# EAGLE schematic GBADVI (EAGLE 9.6.2)

## Sheet 1 of 3
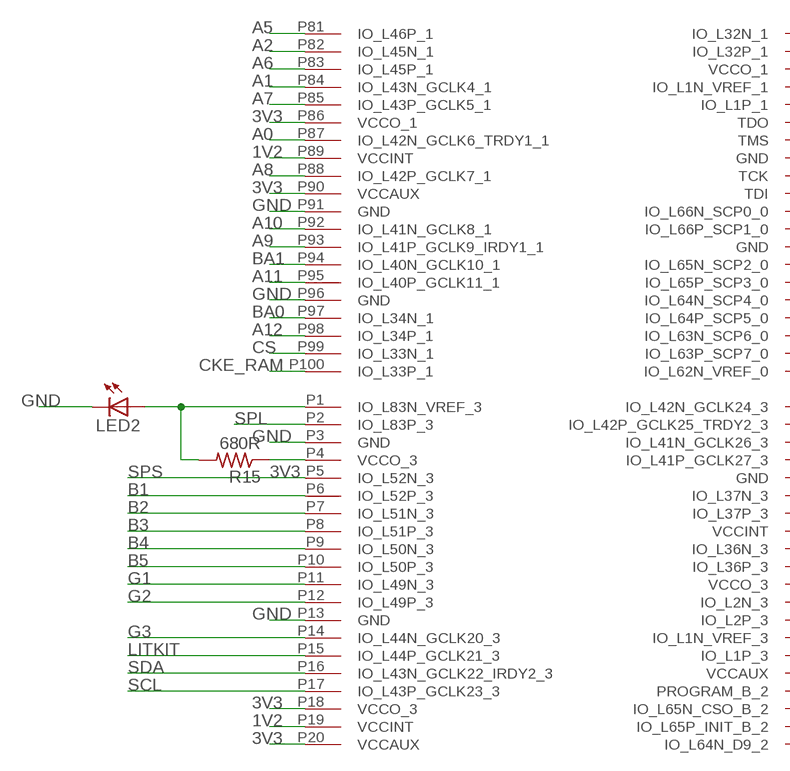
[diagram p0: schematic, sheet 1, part 1 of 2]
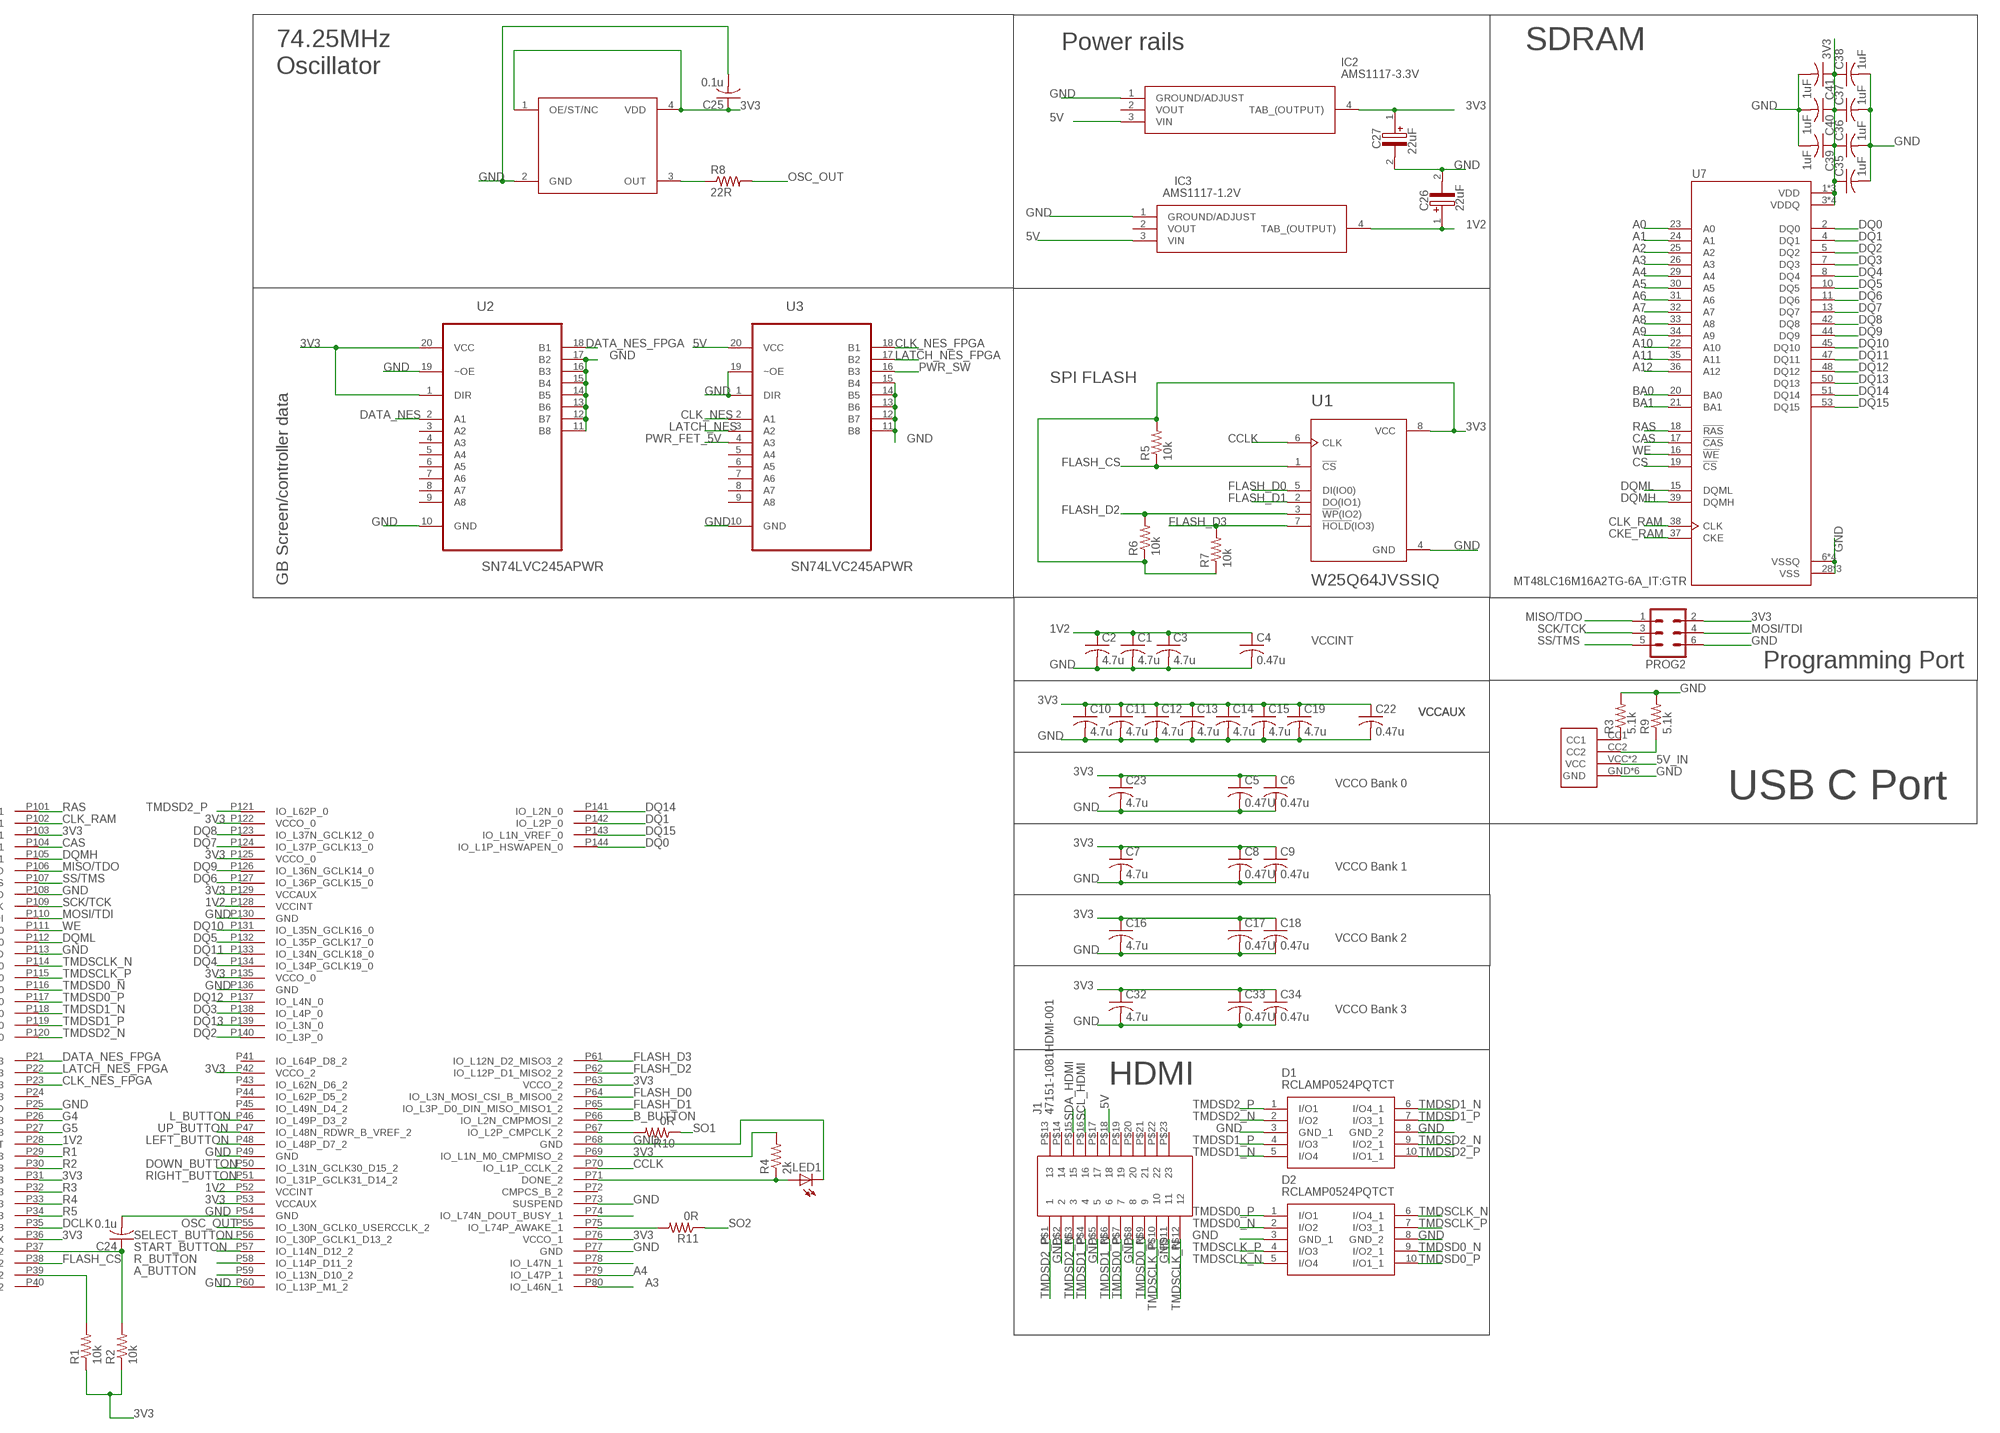
[diagram p1: schematic, sheet 1, part 2 of 2]

### Parts
C1  4.7u  C-USC0603  [C0603]
C2  4.7u  C-USC0603  [C0603]
C3  4.7u  C-USC0603  [C0603]
C4  0.47u  C-USC0603  [C0603]
C5  0.47U  C-USC0603  [C0603]
C6  0.47u  C-USC0603  [C0603]
C7  4.7u  C-USC0603  [C0603]
C8  0.47U  C-USC0603  [C0603]
C9  0.47u  C-USC0603  [C0603]
C10  4.7u  C-USC0603  [C0603]
C11  4.7u  C-USC0603  [C0603]
C12  4.7u  C-USC0603  [C0603]
C13  4.7u  C-USC0603  [C0603]
C14  4.7u  C-USC0603  [C0603]
C15  4.7u  C-USC0603  [C0603]
C16  4.7u  C-USC0603  [C0603]
C17  0.47U  C-USC0603  [C0603]
C18  0.47u  C-USC0603  [C0603]
C19  4.7u  C-USC0603  [C0603]
C22  0.47u  C-USC0603  [C0603]
C23  4.7u  C-USC0603  [C0603]
C24  0.1u  C-USC0603  [C0603]
C25  0.1u  C-USC0603  [C0603]
C26  22uF  293D106X9016A2TE3  [CAPPM3216X180N]
C27  22uF  293D106X9016A2TE3  [CAPPM3216X180N]
C32  4.7u  C-USC0603  [C0603]
C33  0.47U  C-USC0603  [C0603]
C34  0.47u  C-USC0603  [C0603]
C35  1uF  C-USC0603  [C0603]
C36  1uF  C-USC0603  [C0603]
C37  1uF  C-USC0603  [C0603]
C38  1uF  C-USC0603  [C0603]
C39  1uF  C-USC0603  [C0603]
C40  1uF  C-USC0603  [C0603]
C41  1uF  C-USC0603  [C0603]
D1  RCLAMP0524PQTCT  [RCLAMP0524P]
D2  RCLAMP0524PQTCT  [RCLAMP0524P]
IC2  AMS1117-3.3V  [SOT229P700X180-4N]
IC3  AMS1117-1.2V  AMS1117-3.3V  [SOT229P700X180-4N]
J1  47151-1081HDMI-001  [HDMI-001]
LED1  LEDCHIP-LED0603  [CHIP-LED0603]
LED2  LEDCHIP-LED0603  [CHIP-LED0603]
PROG2  MA03-2  [MA03-2]
R1  10k  R-US_R0603  [R0603]
R2  10k  R-US_R0603  [R0603]
R3  5.1k  R-US_R0603  [R0603]
R4  2k  R-US_R0603  [R0603]
R5  10k  R-US_R0603  [R0603]
R6  10k  R-US_R0603  [R0603]
R7  10k  R-US_R0603  [R0603]
R8  22R  R-US_R0603  [R0603]
R9  5.1k  R-US_R0603  [R0603]
R10  0R  R-US_R0603  [R0603]
R11  0R  R-US_R0603  [R0603]
R15  680R  R-US_R0603  [R0603]
U1  W25Q64JVSSIQ  W25Q64BVSSIG  [SOIC127P790X216-8N]
U2  SN74LVC245APWR  [SOP65P640X120-20N]
U3  SN74LVC245APWR  [SOP65P640X120-20N]
U7  MT48LC16M16A2TG-6A_IT:GTR  [SOP80P1176X120-54N]
U$1  O50327425MEDH4MI  SIT1602BI-82-33E-75.250000YO50327425MEDH4MI  [OSC_ECS-3518-640-B-TR]
U$2  XC6SLX9-2TQG144C  [TQ144]
U$5  POWER_USBC  [USB-C]

### Nets
1V2: C1.1 C2.1 C3.1 C4.1 C26.1(+) IC3.4(TAB_(OUTPUT)) U$2.P19(VCCINT) U$2.P28(VCCINT) U$2.P52(VCCINT) U$2.P89(VCCINT) U$2.P128(VCCINT)
3V3: C5.1 C6.1 C7.1 C8.1 C9.1 C10.1 C11.1 C12.1 C13.1 C14.1 C15.1 C16.1 C17.1 C18.1 C19.1 C22.1 C23.1 C25.1 C27.1(+) C32.1 C33.1 C34.1 C35.1 C36.1 C37.1 C38.1 C39.1 C40.1 C41.1 IC2.4(TAB_(OUTPUT)) PROG2.2 R1.1 R2.1 R4.2 R5.2 R6.1 R7.1 R15.1 U1.8(VCC) U2.1(DIR) U2.20(VCC) U7.1(VDD) U7.3(VDDQ) U7.9(VDDQ) U7.14(VDD) U7.27(VDD) U7.43(VDDQ) U7.49(VDDQ) U$1.1(OE/ST/NC) U$1.4(VDD) U$2.P4(VCCO_3) U$2.P18(VCCO_3) U$2.P20(VCCAUX) U$2.P31(VCCO_3) U$2.P36(VCCAUX) U$2.P42(VCCO_2) U$2.P53(VCCAUX) U$2.P63(VCCO_2) U$2.P69(IO_L1N_M0_CMPMISO_2) U$2.P76(VCCO_1) U$2.P86(VCCO_1) U$2.P90(VCCAUX) U$2.P103(VCCO_1) U$2.P122(VCCO_0) U$2.P125(VCCO_0) U$2.P129(VCCAUX) U$2.P135(VCCO_0) ; also sheet 2
5V: IC2.3(VIN) IC3.3(VIN) J1.P$18 U3.20(VCC) ; also sheet 2,3
5V_IN: U$5.VCC U$5.VCC1(VCC) ; also sheet 3
A0: U7.23(A0) U$2.P87(IO_L42N_GCLK6_TRDY1_1)
A1: U7.24(A1) U$2.P84(IO_L43N_GCLK4_1)
A2: U7.25(A2) U$2.P82(IO_L45N_1)
A3: U7.26(A3) U$2.P80(IO_L46N_1)
A4: U7.29(A4) U$2.P79(IO_L47P_1)
A5: U7.30(A5) U$2.P81(IO_L46P_1)
A6: U7.31(A6) U$2.P83(IO_L45P_1)
A7: U7.32(A7) U$2.P85(IO_L43P_GCLK5_1)
A8: U7.33(A8) U$2.P88(IO_L42P_GCLK7_1)
A9: U7.34(A9) U$2.P93(IO_L41P_GCLK9_IRDY1_1)
A10: U7.22(A10) U$2.P92(IO_L41N_GCLK8_1)
A11: U7.35(A11) U$2.P95(IO_L40P_GCLK11_1)
A12: U7.36(A12) U$2.P98(IO_L34P_1)
A_BUTTON: U$2.P59(IO_L13N_D10_2) ; also sheet 2
B1: U$2.P6(IO_L52P_3) ; also sheet 2
B2: U$2.P7(IO_L51N_3) ; also sheet 2
B3: U$2.P8(IO_L51P_3) ; also sheet 2
B4: U$2.P9(IO_L50N_3) ; also sheet 2
B5: U$2.P10(IO_L50P_3) ; also sheet 2
B_BUTTON: U$2.P66(IO_L2N_CMPMOSI_2) ; also sheet 2
BA0: U7.20(BA0) U$2.P97(IO_L34N_1)
BA1: U7.21(BA1) U$2.P94(IO_L40N_GCLK10_1)
CAS: U7.17(!CAS) U$2.P104(IO_L1N_VREF_1)
CCLK: U1.6(CLK) U$2.P70(IO_L1P_CCLK_2)
CKE_RAM: U7.37(CKE) U$2.P100(IO_L33P_1)
CLK_NES: U3.2(A1) ; also sheet 2
CLK_NES_FPGA: U3.18(B1) U$2.P23(IO_L41N_GCLK26_3)
CLK_RAM: U7.38(CLK) U$2.P102(IO_L32P_1)
CS: U7.19(!CS) U$2.P99(IO_L33N_1)
DATA_NES: U2.2(A1) ; also sheet 2
DATA_NES_FPGA: U2.18(B1) U$2.P21(IO_L42N_GCLK24_3)
DCLK: U$2.P35(IO_L1P_3) ; also sheet 2
DOWN_BUTTON: U$2.P50(IO_L31N_GCLK30_D15_2) ; also sheet 2
DQ0: U7.2(DQ0) U$2.P144(IO_L1P_HSWAPEN_0)
DQ1: U7.4(DQ1) U$2.P142(IO_L2P_0)
DQ2: U7.5(DQ2) U$2.P140(IO_L3P_0)
DQ3: U7.7(DQ3) U$2.P138(IO_L4P_0)
DQ4: U7.8(DQ4) U$2.P134(IO_L34P_GCLK19_0)
DQ5: U7.10(DQ5) U$2.P132(IO_L35P_GCLK17_0)
DQ6: U7.11(DQ6) U$2.P127(IO_L36P_GCLK15_0)
DQ7: U7.13(DQ7) U$2.P124(IO_L37P_GCLK13_0)
DQ8: U7.42(DQ8) U$2.P123(IO_L37N_GCLK12_0)
DQ9: U7.44(DQ9) U$2.P126(IO_L36N_GCLK14_0)
DQ10: U7.45(DQ10) U$2.P131(IO_L35N_GCLK16_0)
DQ11: U7.47(DQ11) U$2.P133(IO_L34N_GCLK18_0)
DQ12: U7.48(DQ12) U$2.P137(IO_L4N_0)
DQ13: U7.50(DQ13) U$2.P139(IO_L3N_0)
DQ14: U7.51(DQ14) U$2.P141(IO_L2N_0)
DQ15: U7.53(DQ15) U$2.P143(IO_L1N_VREF_0)
DQMH: U7.39(DQMH) U$2.P105(IO_L1P_1)
DQML: U7.15(DQML) U$2.P112(IO_L66P_SCP1_0)
FLASH_CS: R5.1 U1.1(!CS) U$2.P38(IO_L65N_CSO_B_2)
FLASH_D0: U1.5(DI(IO0)) U$2.P64(IO_L3N_MOSI_CSI_B_MISO0_2)
FLASH_D1: U1.2(DO(IO1)) U$2.P65(IO_L3P_D0_DIN_MISO_MISO1_2)
FLASH_D2: R6.2 U1.3(!WP!(IO2)) U$2.P62(IO_L12P_D1_MISO2_2)
FLASH_D3: R7.2 U1.7(!HOLD!(IO3)) U$2.P61(IO_L12N_D2_MISO3_2)
G1: U$2.P11(IO_L49N_3) ; also sheet 2
G2: U$2.P12(IO_L49P_3) ; also sheet 2
G3: U$2.P14(IO_L44N_GCLK20_3) ; also sheet 2
G4: U$2.P26(IO_L37N_3) ; also sheet 2
G5: U$2.P27(IO_L37P_3) ; also sheet 2
GND: C1.2 C2.2 C3.2 C4.2 C5.2 C6.2 C7.2 C8.2 C9.2 C10.2 C11.2 C12.2 C13.2 C14.2 C15.2 C16.2 C17.2 C18.2 C19.2 C22.2 C23.2 C24.2 C25.2 C26.2(-) C27.2(-) C32.2 C33.2 C34.2 C35.2 C36.2 C37.2 C38.2 C39.2 C40.2 C41.2 D1.3(GND_1) D1.8(GND_2) D2.3(GND_1) D2.8(GND_2) IC2.1(GROUND/ADJUST) IC3.1(GROUND/ADJUST) J1.P$2 J1.P$5 J1.P$8 J1.P$11 LED1.C LED2.C PROG2.6 R3.2 R9.2 U1.4(GND) U2.10(GND) U2.11(B8) U2.12(B7) U2.13(B6) U2.14(B5) U2.15(B4) U2.16(B3) U2.17(B2) U2.19(~OE) U3.1(DIR) U3.10(GND) U3.11(B8) U3.12(B7) U3.13(B6) U3.14(B5) U3.15(B4) U3.19(~OE) U7.6(VSSQ) U7.12(VSSQ) U7.28(VSS) U7.41(VSS) U7.46(VSSQ) U7.52(VSSQ) U7.54(VSS) U$1.2(GND) U$2.P3(GND) U$2.P13(GND) U$2.P25(GND) U$2.P49(GND) U$2.P54(GND) U$2.P60(IO_L13P_M1_2) U$2.P68(GND) U$2.P73(SUSPEND) U$2.P77(GND) U$2.P91(GND) U$2.P96(GND) U$2.P108(GND) U$2.P113(GND) U$2.P130(GND) U$2.P136(GND) U$5.GND U$5.GND1(GND) U$5.P$7(GND) U$5.P$8(GND) U$5.P$9(GND) U$5.P$10(GND) ; also sheet 2,3
L_BUTTON: U$2.P46(IO_L49P_D3_2) ; also sheet 2
LATCH_NES: U3.3(A2) ; also sheet 2
LATCH_NES_FPGA: U3.17(B2) U$2.P22(IO_L42P_GCLK25_TRDY2_3)
LEFT_BUTTON: U$2.P48(IO_L48P_D7_2) ; also sheet 2
LITKIT: U$2.P15(IO_L44P_GCLK21_3) ; also sheet 2
MISO/TDO: PROG2.1 U$2.P106(TDO)
MOSI/TDI: PROG2.4 U$2.P110(TDI)
N$1: R1.2 U$2.P39(IO_L65P_INIT_B_2)
N$2: C24.1 R2.2 U$2.P37(PROGRAM_B_2)
N$3: R3.1 U$5.CC1
N$4: R8.1 U$1.3(OUT)
N$5: R9.1 U$5.CC2
N$6: R10.2 U$2.P67(IO_L2P_CMPCLK_2)
N$7: R11.2 U$2.P75(IO_L74P_AWAKE_1)
N$18: U$2.P74(IO_L74N_DOUT_BUSY_1)
N$19: LED1.A R4.1 U$2.P71(DONE_2)
N$20: LED2.A R15.2 U$2.P1(IO_L83N_VREF_3)
N$24: U$2.P78(IO_L47N_1)
OSC_OUT: R8.2 U$2.P55(IO_L30N_GCLK0_USERCCLK_2)
PWR_FET_5V: U3.4(A3)
PWR_SW: U3.16(B3)
R1: U$2.P29(IO_L36N_3) ; also sheet 2
R2: U$2.P30(IO_L36P_3) ; also sheet 2
R3: U$2.P32(IO_L2N_3) ; also sheet 2
R4: U$2.P33(IO_L2P_3) ; also sheet 2
R5: U$2.P34(IO_L1N_VREF_3) ; also sheet 2
R_BUTTON: U$2.P58(IO_L14P_D11_2) ; also sheet 2
RAS: U7.18(!RAS) U$2.P101(IO_L32N_1)
RIGHT_BUTTON: U$2.P51(IO_L31P_GCLK31_D14_2) ; also sheet 2
SCK/TCK: PROG2.3 U$2.P109(TCK)
SCL: U$2.P17(IO_L43P_GCLK23_3) ; also sheet 2
SCL_HDMI: J1.P$16
SDA: U$2.P16(IO_L43N_GCLK22_IRDY2_3) ; also sheet 2
SDA_HDMI: J1.P$15
SELECT_BUTTON: U$2.P56(IO_L30P_GCLK1_D13_2) ; also sheet 2
SO1: R10.1 ; also sheet 2
SO2: R11.1 ; also sheet 2
SPL: U$2.P2(IO_L83P_3) ; also sheet 2
SPS: U$2.P5(IO_L52N_3) ; also sheet 2
SS/TMS: PROG2.5 U$2.P107(TMS)
START_BUTTON: U$2.P57(IO_L14N_D12_2) ; also sheet 2
TMDSCLK_N: D2.5(I/O4) D2.6(I/O4_1) J1.P$12 U$2.P114(IO_L65N_SCP2_0)
TMDSCLK_P: D2.4(I/O3) D2.7(I/O3_1) J1.P$10 U$2.P115(IO_L65P_SCP3_0)
TMDSD0_N: D2.2(I/O2) D2.9(I/O2_1) J1.P$9 U$2.P116(IO_L64N_SCP4_0)
TMDSD0_P: D2.1(I/O1) D2.10(I/O1_1) J1.P$7 U$2.P117(IO_L64P_SCP5_0)
TMDSD1_N: D1.5(I/O4) D1.6(I/O4_1) J1.P$6 U$2.P118(IO_L63N_SCP6_0)
TMDSD1_P: D1.4(I/O3) D1.7(I/O3_1) J1.P$4 U$2.P119(IO_L63P_SCP7_0)
TMDSD2_N: D1.2(I/O2) D1.9(I/O2_1) J1.P$3 U$2.P120(IO_L62N_VREF_0)
TMDSD2_P: D1.1(I/O1) D1.10(I/O1_1) J1.P$1 U$2.P121(IO_L62P_0)
UP_BUTTON: U$2.P47(IO_L48N_RDWR_B_VREF_2) ; also sheet 2
WE: U7.16(!WE) U$2.P111(IO_L66N_SCP0_0)
Unconnected: IC2.2(VOUT) IC3.2(VOUT) J1.P$13 J1.P$14 J1.P$17 J1.P$19 J1.P$20 J1.P$21 J1.P$22 J1.P$23 U2.3(A2) U2.4(A3) U2.5(A4) U2.6(A5) U2.7(A6) U2.8(A7) U2.9(A8) U3.5(A4) U3.6(A5) U3.7(A6) U3.8(A7) U3.9(A8) U$2.P24(IO_L41P_GCLK27_3) U$2.P40(IO_L64N_D9_2) U$2.P41(IO_L64P_D8_2) U$2.P43(IO_L62N_D6_2) U$2.P44(IO_L62P_D5_2) U$2.P45(IO_L49N_D4_2) U$2.P72(CMPCS_B_2)

### Notes on the sheet
- Power rails | SDRAM
- 74.25MHz
  Oscillator
- SPI FLASH
- GB Screen/controller data
- VCCINT
- Programming Port
- VCCAUX | VCCAUX
- VCCO Bank 0
- USB C Port
- VCCO Bank 1
- VCCO Bank 2
- VCCO Bank 3
- HDMI

## Sheet 2 of 3
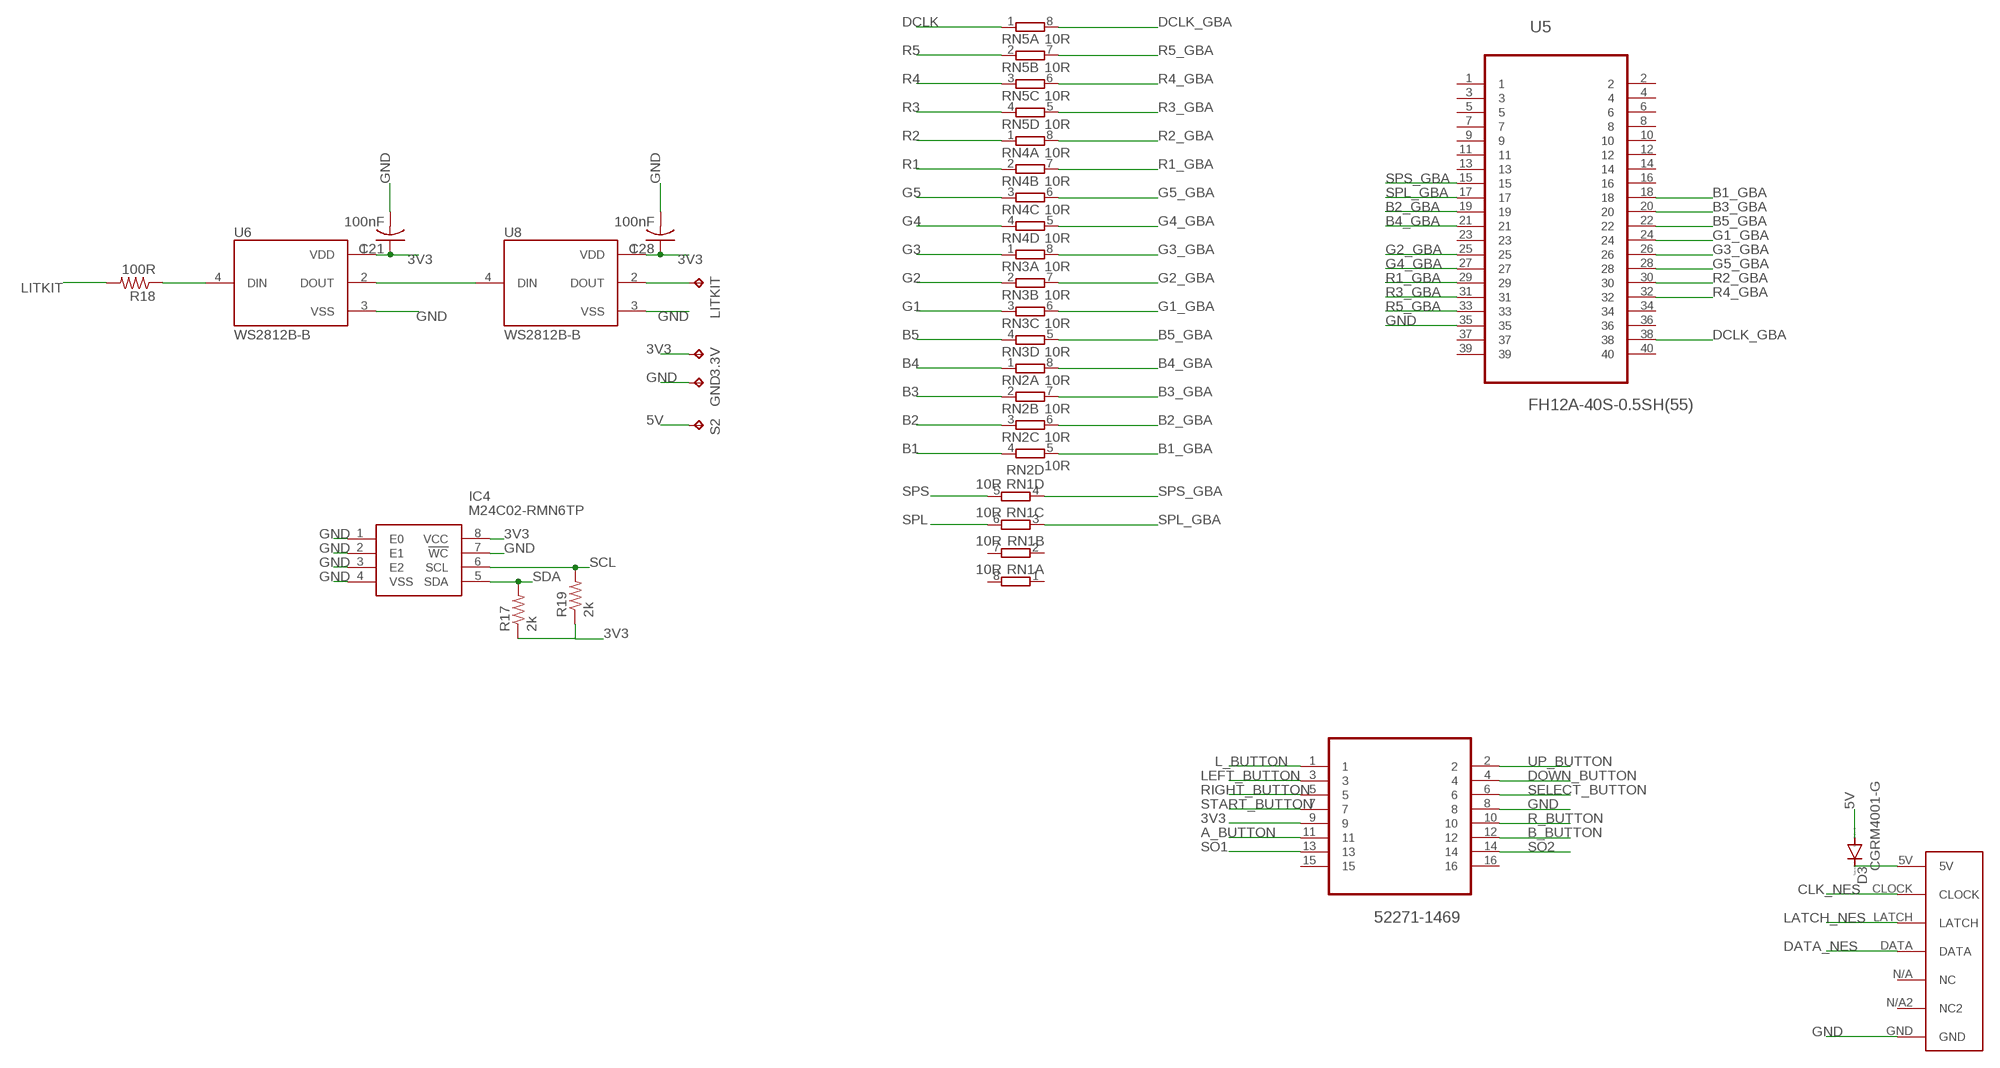
[diagram p2: schematic, sheet 2]

### Parts
3.3V  TPB1,27  [B1,27]
C21  100nF  C-USC0603  [C0603]
C28  100nF  C-USC0603  [C0603]
D3  CGRM4001-G  [SOD-123_MINI-SMA]
GND  TPB1,27  [B1,27]
IC4  M24C02-RMN6TP  [SOIC127P600X175-8N]
LITKIT  TPB1,27  [B1,27]
R17  2k  R-US_R0603  [R0603]
R18  100R  R-US_R0603  [R0603]
R19  2k  R-US_R0603  [R0603]
RN1  10R  4R-N0603-ARV  [0603-ARV]
RN2  10R  4R-N0603-ARV  [0603-ARV]
RN3  10R  4R-N0603-ARV  [0603-ARV]
RN4  10R  4R-N0603-ARV  [0603-ARV]
RN5  10R  4R-N0603-ARV  [0603-ARV]
S2  TPB1,27  [B1,27]
U4  52271-1469  [MOLEX_52271-1469]
U5  FH12A-40S-0.5SH(55)  [HIROSE_FH12A-40S-0.5SH(55)]
U6  WS2812B-B  [LED_WS2812B-B]
U8  WS2812B-B  [LED_WS2812B-B]
U$3  SNES_CONT  [SNES_CONT]

### Nets
3V3: 3.3V.TP C21.1 C28.1 IC4.8(VCC) R17.1 R19.1 U4.9 U6.1(VDD) U8.1(VDD) ; also sheet 1
5V: D3.A S2.TP ; also sheet 1,3
A_BUTTON: U4.11 ; also sheet 1
B1: RN2.4 ; also sheet 1
B1_GBA: RN2.5 U5.18
B2: RN2.3 ; also sheet 1
B2_GBA: RN2.6 U5.19
B3: RN2.2 ; also sheet 1
B3_GBA: RN2.7 U5.20
B4: RN2.1 ; also sheet 1
B4_GBA: RN2.8 U5.21
B5: RN3.4 ; also sheet 1
B5_GBA: RN3.5 U5.22
B_BUTTON: U4.12 ; also sheet 1
CLK_NES: U$3.CLOCK ; also sheet 1
DATA_NES: U$3.DATA ; also sheet 1
DCLK: RN5.1 ; also sheet 1
DCLK_GBA: RN5.8 U5.38
DOWN_BUTTON: U4.4 ; also sheet 1
G1: RN3.3 ; also sheet 1
G1_GBA: RN3.6 U5.24
G2: RN3.2 ; also sheet 1
G2_GBA: RN3.7 U5.25
G3: RN3.1 ; also sheet 1
G3_GBA: RN3.8 U5.26
G4: RN4.4 ; also sheet 1
G4_GBA: RN4.5 U5.27
G5: RN4.3 ; also sheet 1
G5_GBA: RN4.6 U5.28
GND: C21.2 C28.2 GND.TP IC4.1(E0) IC4.2(E1) IC4.3(E2) IC4.4(VSS) IC4.7(!WC) U4.8 U5.35 U6.3(VSS) U8.3(VSS) U$3.GND ; also sheet 1,3
L_BUTTON: U4.1 ; also sheet 1
LATCH_NES: U$3.LATCH ; also sheet 1
LEFT_BUTTON: U4.3 ; also sheet 1
LITKIT: R18.2 ; also sheet 1
N$8: D3.C U$3.5V
N$14: R18.1 U6.4(DIN)
N$16: U6.2(DOUT) U8.4(DIN)
N$22: LITKIT.TP U8.2(DOUT)
R1: RN4.2 ; also sheet 1
R1_GBA: RN4.7 U5.29
R2: RN4.1 ; also sheet 1
R2_GBA: RN4.8 U5.30
R3: RN5.4 ; also sheet 1
R3_GBA: RN5.5 U5.31
R4: RN5.3 ; also sheet 1
R4_GBA: RN5.6 U5.32
R5: RN5.2 ; also sheet 1
R5_GBA: RN5.7 U5.33
R_BUTTON: U4.10 ; also sheet 1
RIGHT_BUTTON: U4.5 ; also sheet 1
SCL: IC4.6(SCL) R19.2 ; also sheet 1
SDA: IC4.5(SDA) R17.2 ; also sheet 1
SELECT_BUTTON: U4.6 ; also sheet 1
SO1: U4.13 ; also sheet 1
SO2: U4.14 ; also sheet 1
SPL: RN1.6 ; also sheet 1
SPL_GBA: RN1.3 U5.17
SPS: RN1.5 ; also sheet 1
SPS_GBA: RN1.4 U5.15
START_BUTTON: U4.7 ; also sheet 1
UP_BUTTON: U4.2 ; also sheet 1
Unconnected: RN1.1 RN1.2 RN1.7 RN1.8 U4.15 U4.16 U5.1 U5.2 U5.3 U5.4 U5.5 U5.6 U5.7 U5.8 U5.9 U5.10 U5.11 U5.12 U5.13 U5.14 U5.16 U5.23 U5.34 U5.36 U5.37 U5.39 U5.40 U$3.N/A2(NC2) U$3.N/A(NC)

## Sheet 3 of 3
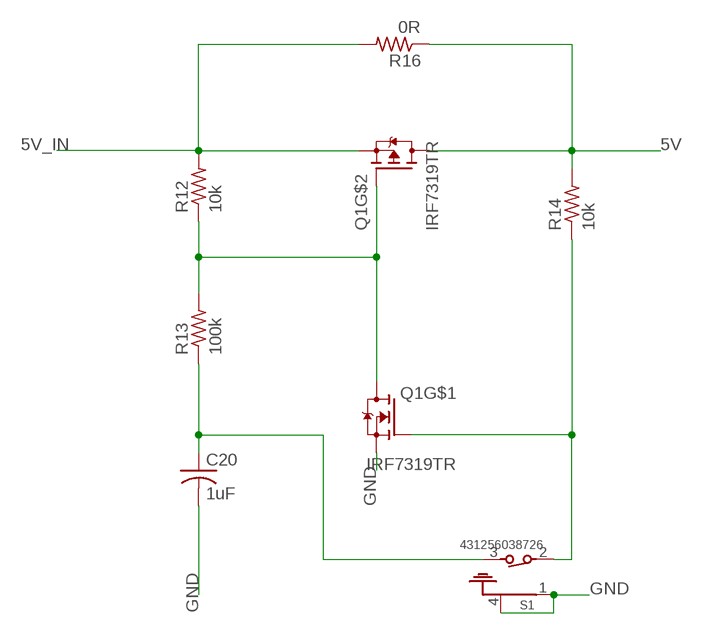
[diagram p3: schematic, sheet 3]

### Parts
C20  1uF  C-USC0603  [C0603]
Q1  IRF7319TR  [SOIC127P600X175-8N]
R12  10k  R-US_R0603  [R0603]
R13  100k  R-US_R0603  [R0603]
R14  10k  R-US_R0603  [R0603]
R16  0R  R-US_R0603  [R0603]
S1  431256038726  [4312560387X6]

### Nets
5V: Q1.5(D) Q1.6(D) R14.2 R16.1 ; also sheet 1,2
5V_IN: Q1.3(S) R12.2 R16.2 ; also sheet 1
GND: C20.2 Q1.1(S) S1.1(GND1) S1.4(GND) ; also sheet 1,2
N$9: Q1.2(G) R14.1 S1.2
N$11: Q1.4(G) Q1.7(D) Q1.8(D) R12.1 R13.2
N$12: C20.1 R13.1 S1.3

## Library data of the parts
3.3V GND LITKIT S2 = testpad:TP: Test pad
C1-C19 C22-C25 C32-C41 = rcl:C-US: CAPACITOR, American symbol; SPICEPREFIX: C
C20 C21 C28 = adafruit:C-US: CAPACITOR, American symbol
C26 C27 = SamacSys_Parts:293D106X9016A2TE3: Capacitor Tantalum SMT 293D 16V 10uF Vishay 10uF SMD Solid MnO2 Tantalum Electrolytic Capacitor, 16 V dc +/-10%, 293D Series Source: Datasheet <https://componentsearchengine.com/Datasheets/1/293D106X9016A2TE3.pdf>; DESCRIPTION: Capacitor Tantalum SMT 293D 16V 10uF Vishay 10uF SMD Solid MnO2 Tantalum Electrolytic Capacitor, 16 V dc +/-10%, 293D Series; HEIGHT: 1.8mm; MANUFACTURER_NAME: Vishay; MANUFACTURER_PART_NUMBER: 293D106X9016A2TE3; MOUSER2_PART_NUMBER: 74-293D106X9016A2TE3; MOUSER2_PRICE-STOCK: https://www.mouser.com/Search/Refine.aspx?Keyword=74-293D106X9016A2TE3
D1 D2 = SamacSys_Parts:RCLAMP0524PQTCT: ESD Suppressors / TVS Diodes 4-LINE, 5V, 0.8PF ESD/SURG Source: Datasheet <https://componentsearchengine.com/Datasheets/1/RCLAMP0524PQTCT.pdf>; DESCRIPTION: ESD Suppressors / TVS Diodes 4-LINE, 5V, 0.8PF ESD/SURG; HEIGHT: mm; MANUFACTURER_NAME: SEMTECH; MANUFACTURER_PART_NUMBER: RCLAMP0524PQTCT; MOUSER2_PART_NUMBER: 947-RCLAMP0524PQTCT; MOUSER2_PRICE-STOCK: https://www.mouser.com/Search/Refine.aspx?Keyword=947-RCLAMP0524PQTCT
D3 = diode:CGRM400*-G: Molded plasitc,JEDEC SOD-123/Mini SMA Source: Comchip CGRM4001-G.pdf
IC2 IC3 = SamacSys_Parts:AMS1117-3.3V: 1A LOW DROPOUT VOLTAGE REGULATOR, SOT-223 Source: Datasheet <http://www.advanced-monolithic.com/pdf/ds1117.pdf>; DESCRIPTION: 1A LOW DROPOUT VOLTAGE REGULATOR, SOT-223; HEIGHT: 1.8mm; MANUFACTURER_NAME: Advanced Monolithic Systems; MANUFACTURER_PART_NUMBER: ams1117-3.3v
IC4 = M24C02-RMN6TP:M24C02-RMN6TP: M24C02-RMN6TP, Serial EEPROM Memory 2kbit, Serial-I2C, 900ns 1.8 5.5 V, 8-Pin SOIC Source: Datasheet <http://www.st.com/st-web-ui/static/active/en/resource/technical/document/datasheet/DM00071904.pdf>; ARROW_PART_NUMBER: M24C02-RMN6TP; ARROW_PRICE-STOCK: https://www.arrow.com/en/products/m24c02-rmn6tp/stmicroelectronics?region=nac; DESCRIPTION: M24C02-RMN6TP, Serial EEPROM Memory 2kbit, Serial-I2C, 900ns 1.8 5.5 V, 8-Pin SOIC; HEIGHT: 1.75mm; MANUFACTURER_NAME: STMicroelectronics; MANUFACTURER_PART_NUMBER: M24C02-RMN6TP; MOUSER_PART_NUMBER: 511-M24C02-RMN6TP; MOUSER_PRICE-STOCK: https://www.mouser.co.uk/ProductDetail/STMicroelectronics/M24C02-RMN6TP?qs=Jodr3Ka7a6ktinv3aZzndw%3D%3D
J1 = SamacSys_Parts:47151-1081: HDMI, Displayport & DVI Connectors 1.0 HDMI R/A HEADER DMI R/A HEADER ASSY. Source: Datasheet <https://componentsearchengine.com/Datasheets/1/47151-1081.pdf>
LED1 LED2 = adafruit:LED: LED OSRAM: - CHIPLED LG R971, LG N971, LY N971, LG Q971, LY Q971, LO R971, LY R971 LH N974, LH R974 LS Q976, LO Q976, LY Q976 LO Q996 - Hyper CHIPLED LW Q18S LB Q993, LB Q99A, LB R99A - SideLED LS A670, LO A670, LY A670, LG A670, LP A670 LB A673, LV A673, LT A673, LW A673 LH A674 LY A675 LS A676, LA A676, LO A676, LY A676, LW A676 LS A679, LY A679, LG A679 - Hyper Micro SIDELED® LS Y876, LA Y876, LO Y876, LY Y876 LT Y87S - SmartLED LW L88C, LW L88S LB L89C, LB L89S, LG L890 LS L89K, LO L89K, LY L89K LS L896, LA L896, LO L896, LY L896 - TOPLED LS T670, LO T670, LY T670, LG T670, LP T670 LSG T670, LSP T670, LSY T670, LOP T670, LYG T670 LG T671, LOG T671, LSG T671 LB T673, LV T673, LT T673, LW T673 LH T674 LS T676, LA T676, LO T676, LY T676, LB T676, LH T676, LSB T676, LW T676 LB T67C, LV T67C, LT T67C, LS T67K, LO T67K, LY T67K, LW E67C LS E67B, LA E67B, LO E67B, LY E67B, LB E67C, LV E67C, LT E67C LW T67C LS T679, LY T679, LG T679 LS T770, LO T770, LY T770, LG T770, LP T770 LB T773, LV T773, LT T773, LW T773 LH T774 LS E675, LA E675, LY E675, LS T675 LS T776, LA T776, LO T776, LY T776, LB T776 LHGB T686 LT T68C, LB T68C - Hyper Mini TOPLED® LB M676 - Mini TOPLED Santana® LG M470 LS M47K, LO M47K, LY M47K Source: http://www.osram.convergy.de/
PROG2 = con-lstb:MA03-2: PIN HEADER; OC_FARNELL: unknown; OC_NEWARK: unknown
Q1 = IRF7319TR:IRF7319TR: 30V Dual N- and P- Channel HEXFET Power MOSFET in a SO-8 package; AVAILABILITY: Unavailable; DESCRIPTION: Mosfet Array N and P-Channel 30V 2W Surface Mount 8-SO; MF: Infineon Technologies; MP: IRF7319TR; PACKAGE: SOIC-8 Infineon; PRICE: None
R1-R7 R9-R19 = rcl:R-US_: RESISTOR, American symbol; SPICEPREFIX: R
R8 = resistor:R-US_: RESISTOR, American symbol
RN1-RN5 = resistor-dil:4R-N: Array Chip Resistor Source: RS Component / Phycomp; OC_FARNELL: unknown; OC_NEWARK: unknown
S1 = 431256038726:431256038726: WS-TATV THT Tact Switch 6x6 mm Material Properties Cover Material : Carbon Steel Properties Actuator Material:LCP Actuator Flammability Rating:UL94 V-0 Actuator Color:Black; Salmon; White Frame Material:PPA Frame Flammability Rating:UL94 HB Frame Color:Black Contact Material:Stainless Steel Contact Plating:Silver Terminal Material:Copper Alloy Terminal Plating:Silver VR:12 V (DC) Contact Resistance Initial:100 mΩ Contact Resistance After Life Test:2 Ω RISO:100 MΩ Withstanding Voltage:250 V (AC) Qty.:500 Mechanical Properties Stroke 0.25 mm General Information Operating Temperature:-40 up to +85 °C Packaging Properties Packaging:Bulk <https://www.we-online.com/catalog/media/o61137v209%20Family_WS_TST_THT_4312560xx7x6_pf2.jpg> Details see: https://www.we-online.com/catalog/en/TATU_6X6_THT_RIGHT_ANGLED_WITH_GROUND_TERMINAL/ Updated by yingchun,Shan;2020-02-21 2020(C) Würth Elektronik Check prices <https://pricing.snapeda.com/parts/431256038726/Wurth%20Electronics/view-part?ref=eda>; AVAILABILITY: Warning; DESCRIPTION: Tactile Switch SPST-NO Side Actuated Through Hole, Right Angle; MF: Wurth Electronics; MP: 431256038726; PACKAGE: None; PRICE: None; PURCHASE-URL: https://pricing.snapeda.com/search/part/431256038726/?ref=eda
U1 = W25Q64BVSSIG:W25Q64BVSSIG: IC FLASH 64MBIT 80MHZ 8SOIC; AVAILABILITY: Unavailable; DESCRIPTION: FLASH - NOR Memory IC 64Mb _8M x 8_ SPI 80MHz 8-SOIC; MF: Winbond Electronics; MP: W25Q64BVSSIG; PACKAGE: SOIC-8 Winbond; PRICE: None
U2 U3 = SN74LVC245APWR:SN74LVC245APWR: OCTAL BUS TRANSCEIVER WITH 3-STATE OUTPUTS; DESCRIPTION: Octal Bus Transceiver With 3-State Outputs 20-TSSOP -40 to 125; DIGI-KEY_PART_NUMBER: 296-1233-1-ND; DIGI-KEY_PURCHASE_URL: https://www.digikey.com/product-detail/en/texas-instruments/SN74LVC245APWR/296-1233-1-ND/276501?utm_source=snapeda&utm_medium=aggregator&utm_campaign=symbol; MF: Texas Instruments; MP: SN74LVC245APWR; PACKAGE: TSSOP-20 Texas Instruments
U4 = 52271-1469:52271-1469: CONNECTOR, FPC, 1.0MM, 14 WAY Check prices <https://pricing.snapeda.com/parts/52271-1469/Molex/view-part?ref=eda>; AVAILABILITY: Good; DESCRIPTION: 14 Position FPC Connector Contacts, Bottom 0.039 (1.00mm) Surface Mount, Right Angle; MF: Molex; MP: 52271-1469; PACKAGE: None; PRICE: None; PURCHASE-URL: https://pricing.snapeda.com/search/part/52271-1469/?ref=eda
U5 = 40pin_0.5mm_Connector:FH12A-40S-0.5SH(55): SOCKET FFC/FPC, ZIF, 0.5MM, 40WAY Check prices <https://pricing.snapeda.com/parts/FH12A-40S-0.5SH%2855%29/Hirose%20Connector/view-part?ref=eda>; AVAILABILITY: Good; DESCRIPTION: FFC & FPC Connectors 0.5MM 40 POS R/A TOP SMT GLD; MF: Hirose Connector; MP: FH12A-40S-0.5SH(55); PACKAGE: None; PRICE: None; PURCHASE-URL: https://pricing.snapeda.com/search/part/FH12A-40S-0.5SH(55)/?ref=eda
U6 U8 = WS2812B-B:WS2812B-B: Intelligent control LED integrated light source Check availability <https://pricing.snapeda.com/parts/WS2812B-B/Worldsemi/view-part?ref=eda>; AVAILABILITY: In Stock; DESCRIPTION: Intelligent control LED integrated light source; MF: Worldsemi; MP: WS2812B-B; PACKAGE: Package; PRICE: None
U7 = SRAM_MT48LC16M16A2TG-6A_IT_GTR:MT48LC16M16A2TG-6A_IT:GTR: Ic Sdram 256mbit 167mhz 54tsop; AVAILABILITY: Unavailable; DESCRIPTION: SDRAM Memory IC 256Mb (16M x 16) Parallel 167MHz 5.4ns 54-TSOP II; MF: Alliance Memory,; MP: MT48LC16M16A2TG-6A IT:GTR; PACKAGE: TSOP-54 Alliance Memory; PRICE: None
U$1 = SOIC254P1016X440-4N:SIT1602BI-82-33E-75.250000Y
U$2 = XC6SLX9-2TQG144C:XC6SLX9-2TQG144C; AVAILABILITY: Unavailable; DESCRIPTION: FPGA Spartan®-6 LX Family 9152 Cells 45nm _CMOS_ Technology 1.2V 144-Pin TQFP; MF: Xilinx Inc.; MP: XC6SLX9-2TQG144C; PACKAGE: TQFP-144 Xilinx; PRICE: None
U$3 = SNES_CONT:SNES_CONT
U$5 = usbcpower_v1:POWER_USBC